# Altium schematic sheet Connectors.SchDoc
size 420 x 297 mm
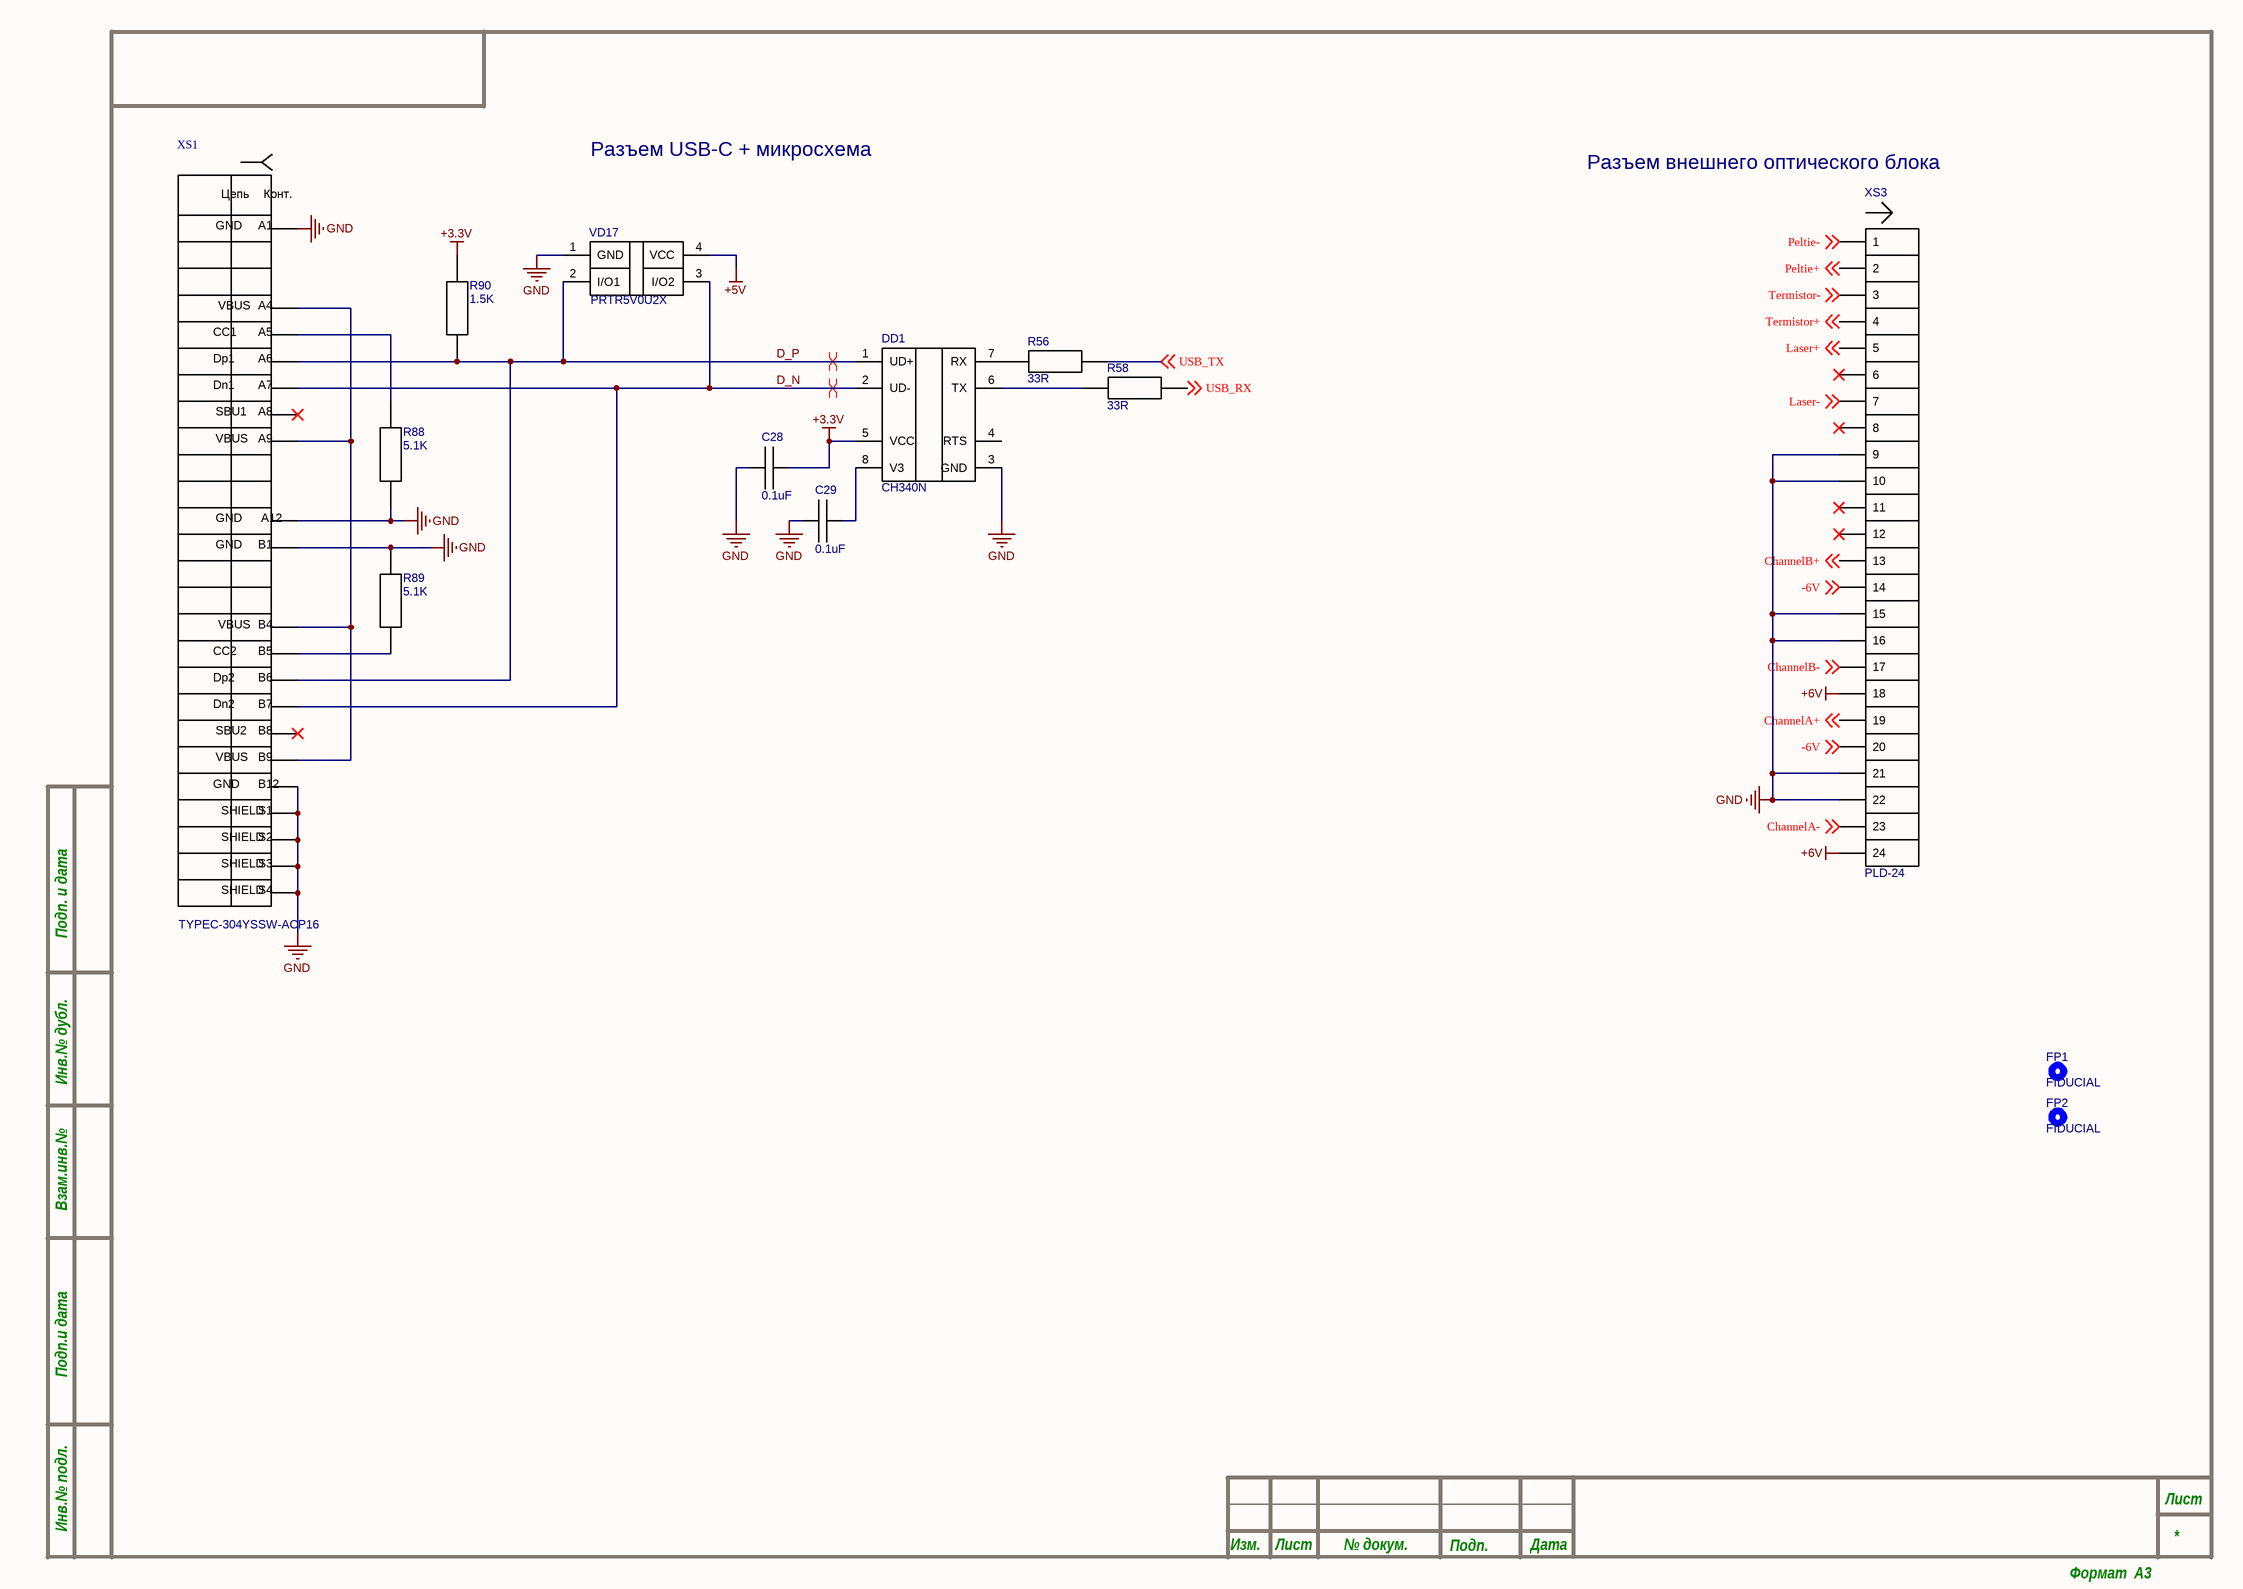
[diagram p0: Connectors.SchDoc]

## Parts
C28  0.1uF  [0603C]
C29  0.1uF  [0603C]
DD1  CH340N  [SOP8]
FP1  FIDUCIAL  [FIDICIAL POINT - R0.3]
FP2  FIDUCIAL  [FIDICIAL POINT - R0.3]
R56  33R  [R0402]
R58  33R  [R0402]
R88  5.1K  [R0402]
R89  5.1K  [R0402]
R90  1.5K  [R0402]
VD17  PRTR5V0U2X  [SOT143B]
XS1  TYPEC-304YSSW-ACP16  [USB-C 16P]
XS3  PLD-24  [PLD-24]

## Nets
+3.3V: C28.2 DD1.5(VCC) R90.2
+5V: VD17.4(VCC)
+6V: XS3.18 XS3.24
GND: C28.1 C29.1 DD1.3(GND) R88.1 R89.2 VD17.1(GND) XS1.A1/B12(GND) XS1.A12/B1(GND) XS1.S1(SHIELD) XS1.S2(SHIELD) XS1.S3(SHIELD) XS1.S4(SHIELD) XS3.9 XS3.10 XS3.15 XS3.16 XS3.21 XS3.22
-6V: XS3.14 XS3.20 ; off-sheet -6V
ChannelA+: XS3.19 ; off-sheet ChannelA+
ChannelA-: XS3.23 ; off-sheet ChannelA-
ChannelB+: XS3.13 ; off-sheet ChannelB+
ChannelB-: XS3.17 ; off-sheet ChannelB-
D_N: DD1.2(UD-) VD17.3(I/O2) XS1.A7(Dn1) XS1.B7(Dn2)
D_P: DD1.1(UD+) R90.1 VD17.2(I/O1) XS1.A6(Dp1) XS1.B6(Dp2)
Laser+: XS3.5 ; off-sheet Laser+
Laser-: XS3.7 ; off-sheet Laser-
Peltie+: XS3.2 ; off-sheet Peltie+
Peltie-: XS3.1 ; off-sheet Peltie-
Termistor+: XS3.4 ; off-sheet Termistor+
Termistor-: XS3.3 ; off-sheet Termistor-
USB_RX: R58.2 ; off-sheet USB_RX
USB_TX: R56.2 ; off-sheet USB_TX
NetC29_2: C29.2 DD1.8(V3)
NetDD1_6: DD1.6(TX) R58.1
NetDD1_7: DD1.7(RX) R56.1
NetR88_2: R88.2 XS1.A5(CC1)
NetR89_1: R89.1 XS1.B5(CC2)
NetXS1_A4/B9: XS1.A4/B9(VBUS) XS1.A9/B4(VBUS)

Not connected (* = marked no-connect by the designer): DD1 4(RTS); XS1 A8(SBU1)* B8(SBU2)*; XS3 6* 8* 11* 12*

## Layout directives
differential pair: D_N, D_P

## Notes on the sheet
- Разъем USB-C + микросхема
- Разъем внешнего оптического блока
- Подп. и дата
- Инв.№ дубл.
- Взам.инв.№
- Подп.и дата
- Инв.№ подл.
- Изм.
- Лист
- № докум.
- Подп.
- Дата
- Формат  A3
- (in symbol TYPEC-304YSSW-ACP16) Цепь; Конт.; A1; A4; A9; A12; B1; B4; B9; B12

## Library data of the parts
C28 C29 = C0603-0.1UF 10% 50V: C0603 0.1UF 10% 50V; Part Number: SMD CAP CER 0.1UF ±10% 50V X7R 0603; Added_by: anton@teslatec.ru; Solder_Amount: 2; Pkg: 0603; Created_at: 10/01/2023; MountType: SMD; Mount: MOUNT
DD1 = CH340N: USB to Serial Port Chip CH340, SOP-8; Added_by: irdolgopolowa@yandex.ru; Pkg: SOIC-8; Solder_Amount: 8; Created_at: 29/10/24; Mount: MOUNT; Part Number: CH340N; MountType: SMD
FP1 FP2 = FIDUCIAL_R0.3: Adder_by: ridel_av@teslatec.ru; Solder_Amount: -; Pkg: -; Created_at: 22/03/2020; Mount: -; MountType: -
R56 R58 = R0402-33R: Resistor SMD 33R 1% 0402; Part Number: SMD RES 33R OHM 1% ±100ppm/°C 0402; Added_by: Rutel@teslatec.ru; Solder_Amount: 2; Pkg: 0402; Created_at: 21/04/2020; MountType: SMD; Mount: MOUNT
R88 R89 = R0402-5.1K: Resistor SMD 5.1K 1% 0402; Part Number: SMD RES 5.1 KOHM 1% ±100ppm/°C 0402; Added_by: Rutel@teslatec.ru; Solder_Amount: 2; Pkg: 0402; Created_at: 21/04/2020; MountType: SMD; Mount: MOUNT
R90 = R0402-1.5K: Resistor SMD 1.5K 1% 0402; Part Number: SMD RES 1.5 KOHM 1% ±100ppm/°C 0402; Added_by: Rutel@teslatec.ru; Solder_Amount: 2; Pkg: 0402; Created_at: 21/04/2020; MountType: SMD; Mount: MOUNT
VD17 = PRTR5V0U2X: PRTR5V0U2X, ESD(Rail-to-Rail), 1pF,  5V; Added_by: irdolgopolowa@yandex.ru; Pkg: SOT-143; Solder_Amount: 4; Created_at: 29/10/24; Mount: MOUNT; MountType: SMD; Part Number: PRTR5V0U2X
XS1 = TYPEC-304YSSW-ACP16: USB Type-C, 16 Pin; Solder_Amount: 16; Added_by: ridel_av@teslatec.ru; MountType: SMD; Mount: MOUNT; Pkg: TYPEC-304YSSW-ACP16; Part Number: TYPEC-304YSSW-ACP16; Created_at: 13/12/2021
XS3 = PLD-24: Pin Header Pitch 2.54mm; Pkg: PLD-24 2.54mm; Solder_Amount: 24; Added_by: andrew@teslatec.ru; MountType: THM; Mount: MOUNT; Part Number: PLD-24; Mating Part: -; Mating Terminals: -; Cable/Wire: -; Created_at: 1/09/2020